# Altium schematic sheet TCP_2_25.SchDoc
size A; SheetNumber: 1; SheetTotal: 1
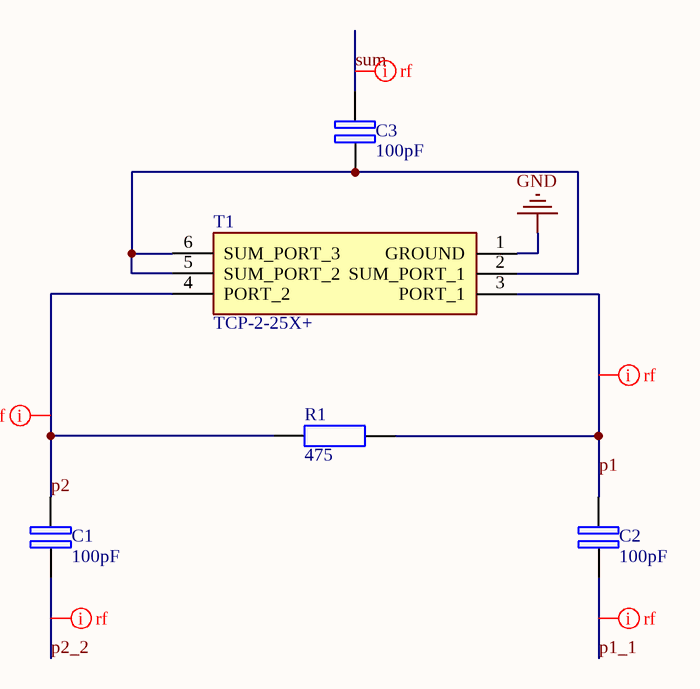
[diagram p0: TCP_2_25.SchDoc]

## Parts
C1  100pF  [CAPC0603X08M]
C2  100pF  [CAPC0603X08M]
C3  100pF  [CAPC0603X08M]
R1  475  [RESC0805X05M]
T1  TCP-2-25X+  [TCP225X]

## Nets
GND: T1.1(GROUND)
p1: C2.2 R1.1 T1.3(PORT_1)
p1_1: C2.1
p2: C1.2 R1.2 T1.4(PORT_2)
p2_2: C1.1
sum: C3.2
NetC3_1: C3.1 T1.2(SUM_PORT_1) T1.5(SUM_PORT_2) T1.6(SUM_PORT_3)

## Layout directives
net class rf: p1, p1_1, p2, p2_2, sum

## Library data of the parts
C1-C3 = Capacitor2P-NP: The capacitor have 2PIN in AXIAL and SMD models. / all non-polar models include.; Created For: HiroNegarPars; Creator: Shahab Azmoodeh; Version: 1.0; Create Date: 2022/07/25; Must Assemble: *; PartNumber: *; Modified Date: 2022/07/25; Company: *; Value: 100pF
R1 = Resistor2P: The resistors have 2PIN in AXIAL and SMD models. / All wattage include in.; Created For: HiroNegarPars; Creator: Shahab Azmoodeh; Version: 1.0; Create Date: 2022/07/24; Must Assemble: *; PartNumber: *; Modified Date: 2022/07/24; Company: *; Value: 475
T1 = TCP-2-25X+: Transformer; Manufacturer_Name: Mini-Circuits; Datasheet Link: https://componentsearchengine.com/Datasheets/1/TCP-2-25X+.pdf; Height: 4.06mm; Manufacturer_Part_Number: TCP-2-25X+; Mouser Part Number: 139-TCP-2-25X; Mouser Price/Stock: https://www.mouser.com/Search/Refine.aspx?Keyword=139-TCP-2-25X